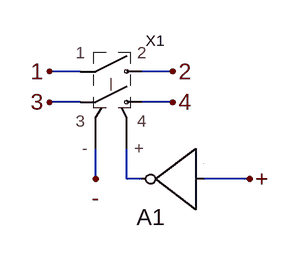
[diagram p0: schematic DPST-NC.asc]
DPST-NC.asc, the LTspice schematic file:
Version 4
SHEET 1 880 680
WIRE 144 0 112 0
WIRE 240 0 208 0
WIRE 144 32 112 32
WIRE 240 32 208 32
WIRE 160 112 160 80
WIRE 192 112 192 80
WIRE 208 112 192 112
WIRE 320 112 272 112
FLAG 320 112 +
FLAG 160 112 -
FLAG 112 0 1
FLAG 240 0 2
FLAG 112 32 3
FLAG 240 32 4
SYMBOL Digital\\inv 272 176 R180
WINDOW 3 8 4 Invisible 2
SYMATTR Value td=10n Vhigh=5
SYMATTR InstName A1
SYMBOL DPST-NO 176 16 R0
SYMATTR InstName X1

The netlist it stands for:
* DPST-NC.asc
A1 + 0 0 0 0 N001 0 0 BUF td=10n Vhigh=5
XX1 1 2 3 4 N001 - DPST-NO  ; pins 1 2 3 4 + -
.backanno
.end